# Altium schematic sheet SPI_Expander_MCP29S09.SchDoc
size A
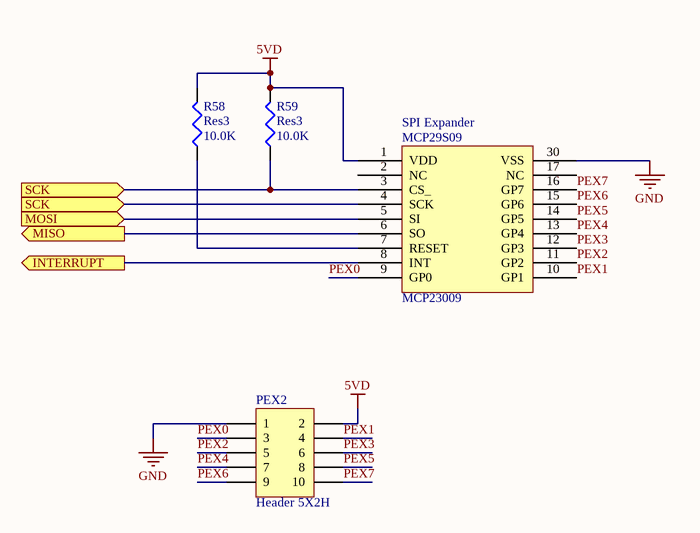
[diagram p0: SPI_Expander_MCP29S09.SchDoc]

## Parts
PEX2  Header 5X2H  [HDR2X5H]
R58  Res3  value 10.0K  [RESC2112X05M]
R59  Res3  value 10.0K  [RESC2112X05M]
SPI_Expander  MCP23009  [MCP23009]

## Ports
INTERRUPT (out), MISO (out), MOSI (in), SCK (in)

## Nets
5VD: PEX2.2 R58.2 R59.2 SPI_Expander.1(VDD)
GND: PEX2.1 SPI_Expander.30(VSS)
INTERRUPT: SPI_Expander.8(INT) ; port INTERRUPT
MISO: SPI_Expander.6(SO) ; port MISO
MOSI: SPI_Expander.5(SI) ; port MOSI
PEX0: PEX2.3 SPI_Expander.9(GP0)
PEX1: PEX2.4 SPI_Expander.10(GP1)
PEX2: PEX2.5 SPI_Expander.11(GP2)
PEX3: PEX2.6 SPI_Expander.12(GP3)
PEX4: PEX2.7 SPI_Expander.13(GP4)
PEX5: PEX2.8 SPI_Expander.14(GP5)
PEX6: PEX2.9 SPI_Expander.15(GP6)
PEX7: PEX2.10 SPI_Expander.16(GP7)
SCK: R59.1 SPI_Expander.3(CS_) SPI_Expander.4(SCK) ; port SCK
NetR58_1: R58.1 SPI_Expander.7(RESET)

Not connected (* = marked no-connect by the designer): SPI_Expander 2(NC) 17(NC)

## Notes on the sheet
- (in symbol MCP23009) MCP29S09

## Library data of the parts
PEX2 = Header 5X2H: Header, 5-Pin, Dual row, Right Angle; LatestRevisionDate: 17-Jul-2002; LatestRevisionNote: Re-released for DXP Platform.; Publisher: Altium Limited
R58 R59 = Resistor_10.0K: RES SMD 10.0K OHM 1% 1/8W 0805; MPN: CRCW080510K0FKEA; PN: 541-10.0KCCT-ND; Name: Resistor_10.0K; URL: http://www.digikey.ca/product-detail/en/CRCW080510K0FKEA/541-10.0KCCT-ND
SPI_Expander = MCP23009: URL: http://www.digikey.com/product-detail/en/MCP23S09-E%2FSO/MCP23S09-E%2FSO-ND/2021356